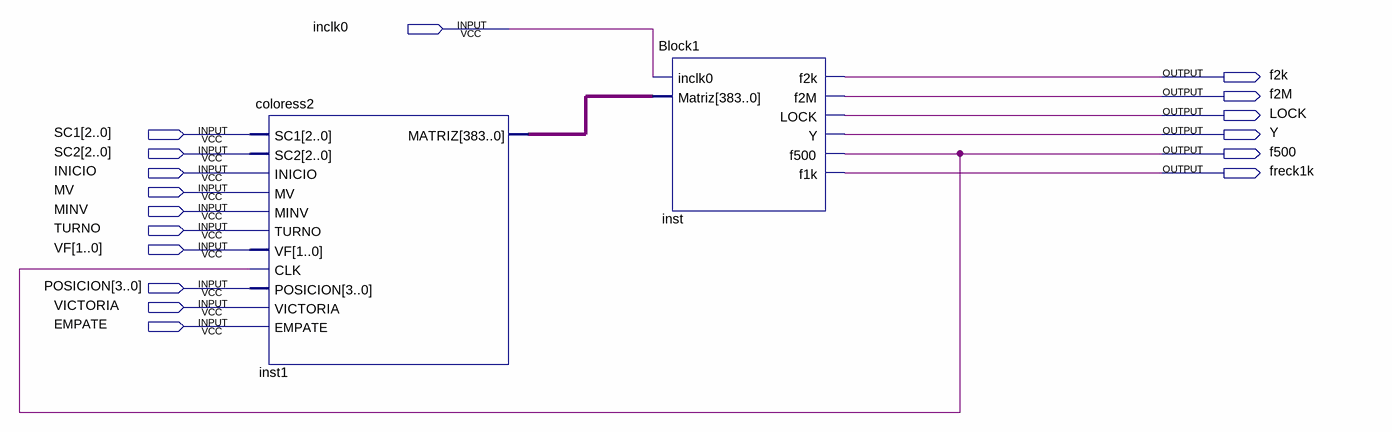
[diagram p0: schematic sheet]
// Quartus schematic subsistema2esquematico.bdf as structural Verilog: 2 symbols, 17 pins
module subsistema2esquematico (
  input  inclk0,
  input  [2:0] SC1,
  input  [2:0] SC2,
  input  INICIO,
  input  MV,
  input  MINV,
  input  TURNO,
  input  [1:0] VF,
  input  [3:0] POSICION,
  input  VICTORIA,
  input  EMPATE,
  output f2k,
  output f2M,
  output LOCK,
  output Y,
  output f500,
  output freck1k
);

  wire [383:0] inst1_matriz;

  coloress2 inst1 (
    .SC1(SC1), .SC2(SC2), .INICIO(INICIO), .MV(MV), .MINV(MINV), .TURNO(TURNO), .VF(VF), .CLK(f500),
    .POSICION(POSICION), .VICTORIA(VICTORIA), .EMPATE(EMPATE), .MATRIZ(inst1_matriz));
  Block1 inst (
    .inclk0(inclk0), .Matriz(inst1_matriz), .f2k(f2k), .f2M(f2M), .LOCK(LOCK), .Y(Y), .f500(f500),
    .f1k(freck1k));
endmodule
